# EAGLE schematic HM2102NLT Transformer Breakout Board (EAGLE 9.5.0)
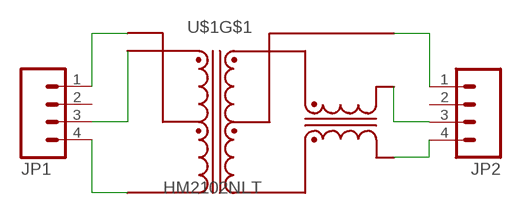
[diagram p0: schematic, sheet 1]

## Parts
JP1  M04  [1X04]
JP2  M04  [1X04]
U$1  HM2102NLT  [HM2102NLT]

## Nets
N$1: JP1.1 U$1.P$2(MCT)
N$2: JP1.3 U$1.P$1(MX+)
N$3: JP1.4 U$1.P$3(MX-)
N$4: JP2.4 U$1.P$10(TD-)
N$5: JP2.3 U$1.P$12(TD+)
N$6: JP2.1 U$1.P$11(TCT)
Unconnected: JP1.2 JP2.2 U$1.P$4(MX+) U$1.P$5(MCT) U$1.P$6(MX-) U$1.P$7(TD-) U$1.P$8(TCT) U$1.P$9(TD+)

## Library data of the parts
JP1 JP2 = HyTechDevices:M04: Standard 4-pin 0.1" header. NOTES ON THE VARIANTS LOCK and LOCK_LONGPADS... This footprint was designed to help hold the alignment of a through-hole component (i.e. 6-pin header) while soldering it into place. You may notice that each hole has been shifted either up or down by 0.005 of an inch from it's more standard position (which is a perfectly straight line). This slight alteration caused the pins (the squares in the middle) to touch the edges of the holes. Because they are alternating, it causes a "brace" to hold the component in place. 0.005 has proven to be the perfect amount of "off-center" position when using our standard breakaway headers. Although looks a little odd when you look at the bare footprint, once you have a header in there, the alteration is very hard to notice. Also,if you push a header all the way into place, it is covered up entirely on the bottom side. This idea of altering the position of holes to aid alignment will be further integrated into the Sparkfun Library for other footprints. It can help hold any component with 3 or more connection pins. Note: The Sparkfun version includes many other packages including surface mount that may be of future interest. Source: Sparkfun <https://github.com/sparkfun/SparkFun-Eagle-Libraries>
U$1 = HyTechDevices:HM2102NLT: 2 Channel SMT Transformer Turns ratio: 1CT: 1CT Isolation Voltage: 4300 VDC Inductance: 150 uH Leakage Inductance: 0.50 uH max DataSheet <https://www.mouser.com/datasheet/2/336/HM2102NL-1218600.pdf>

## Net classes
0 default: width 0.305 mm, clearance 0.152 mm